# Altium schematic sheet 01-Breadboard.SchDoc
size A4
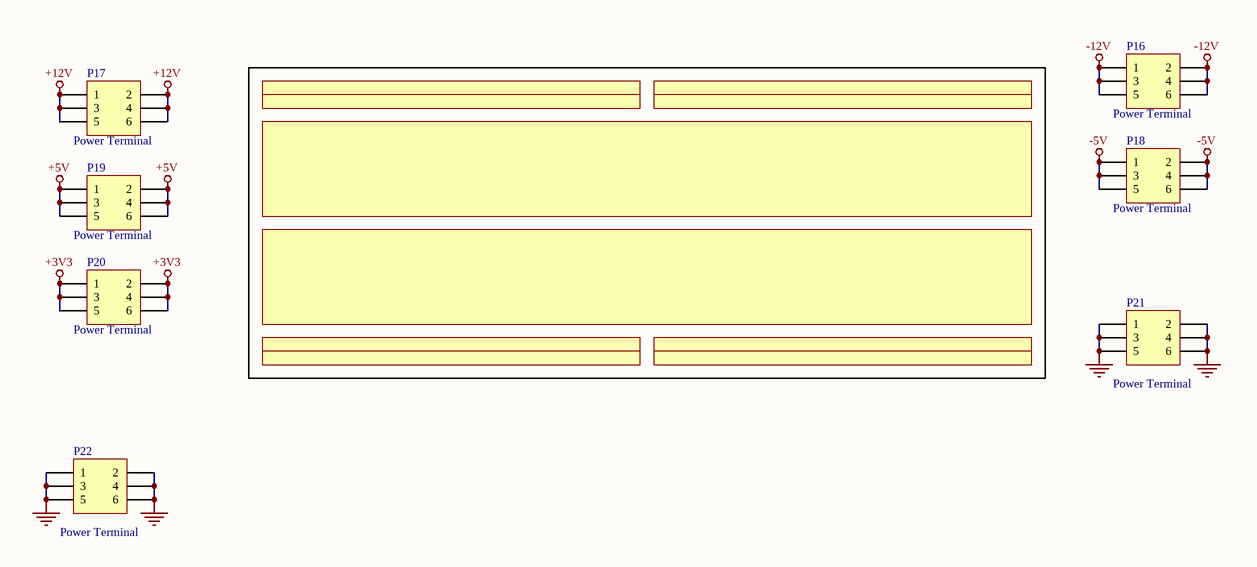
[diagram p0: 01-Breadboard.SchDoc]

## Parts
P16  value Power Terminal  [HDR2X3]  (hidden comment: Header 3X2)
P17  value Power Terminal  [HDR2X3]  (hidden comment: Header 3X2)
P18  value Power Terminal  [HDR2X3]  (hidden comment: Header 3X2)
P19  value Power Terminal  [HDR2X3]  (hidden comment: Header 3X2)
P20  value Power Terminal  [HDR2X3]  (hidden comment: Header 3X2)
P21  value Power Terminal  [HDR2X3]  (hidden comment: Header 3X2)
P22  value Power Terminal  [HDR2X3]  (hidden comment: Header 3X2)

## Nets
+3V3: P20.1 P20.2 P20.3 P20.4 P20.5 P20.6
+5V: P19.1 P19.2 P19.3 P19.4 P19.5 P19.6
+12V: P17.1 P17.2 P17.3 P17.4 P17.5 P17.6
-5V: P18.1 P18.2 P18.3 P18.4 P18.5 P18.6
-12V: P16.1 P16.2 P16.3 P16.4 P16.5 P16.6
GND: P21.1 P21.2 P21.3 P21.4 P21.5 P21.6 P22.1 P22.2 P22.3 P22.4 P22.5 P22.6

## Library data of the parts
P16-P22 = Header 3X2: Header, 3-Pin, Dual row; LatestRevisionDate: 17-Jul-2002; LatestRevisionNote: Re-released for DXP Platform.